# EAGLE schematic relay_block2 (EAGLE 7.6.0)
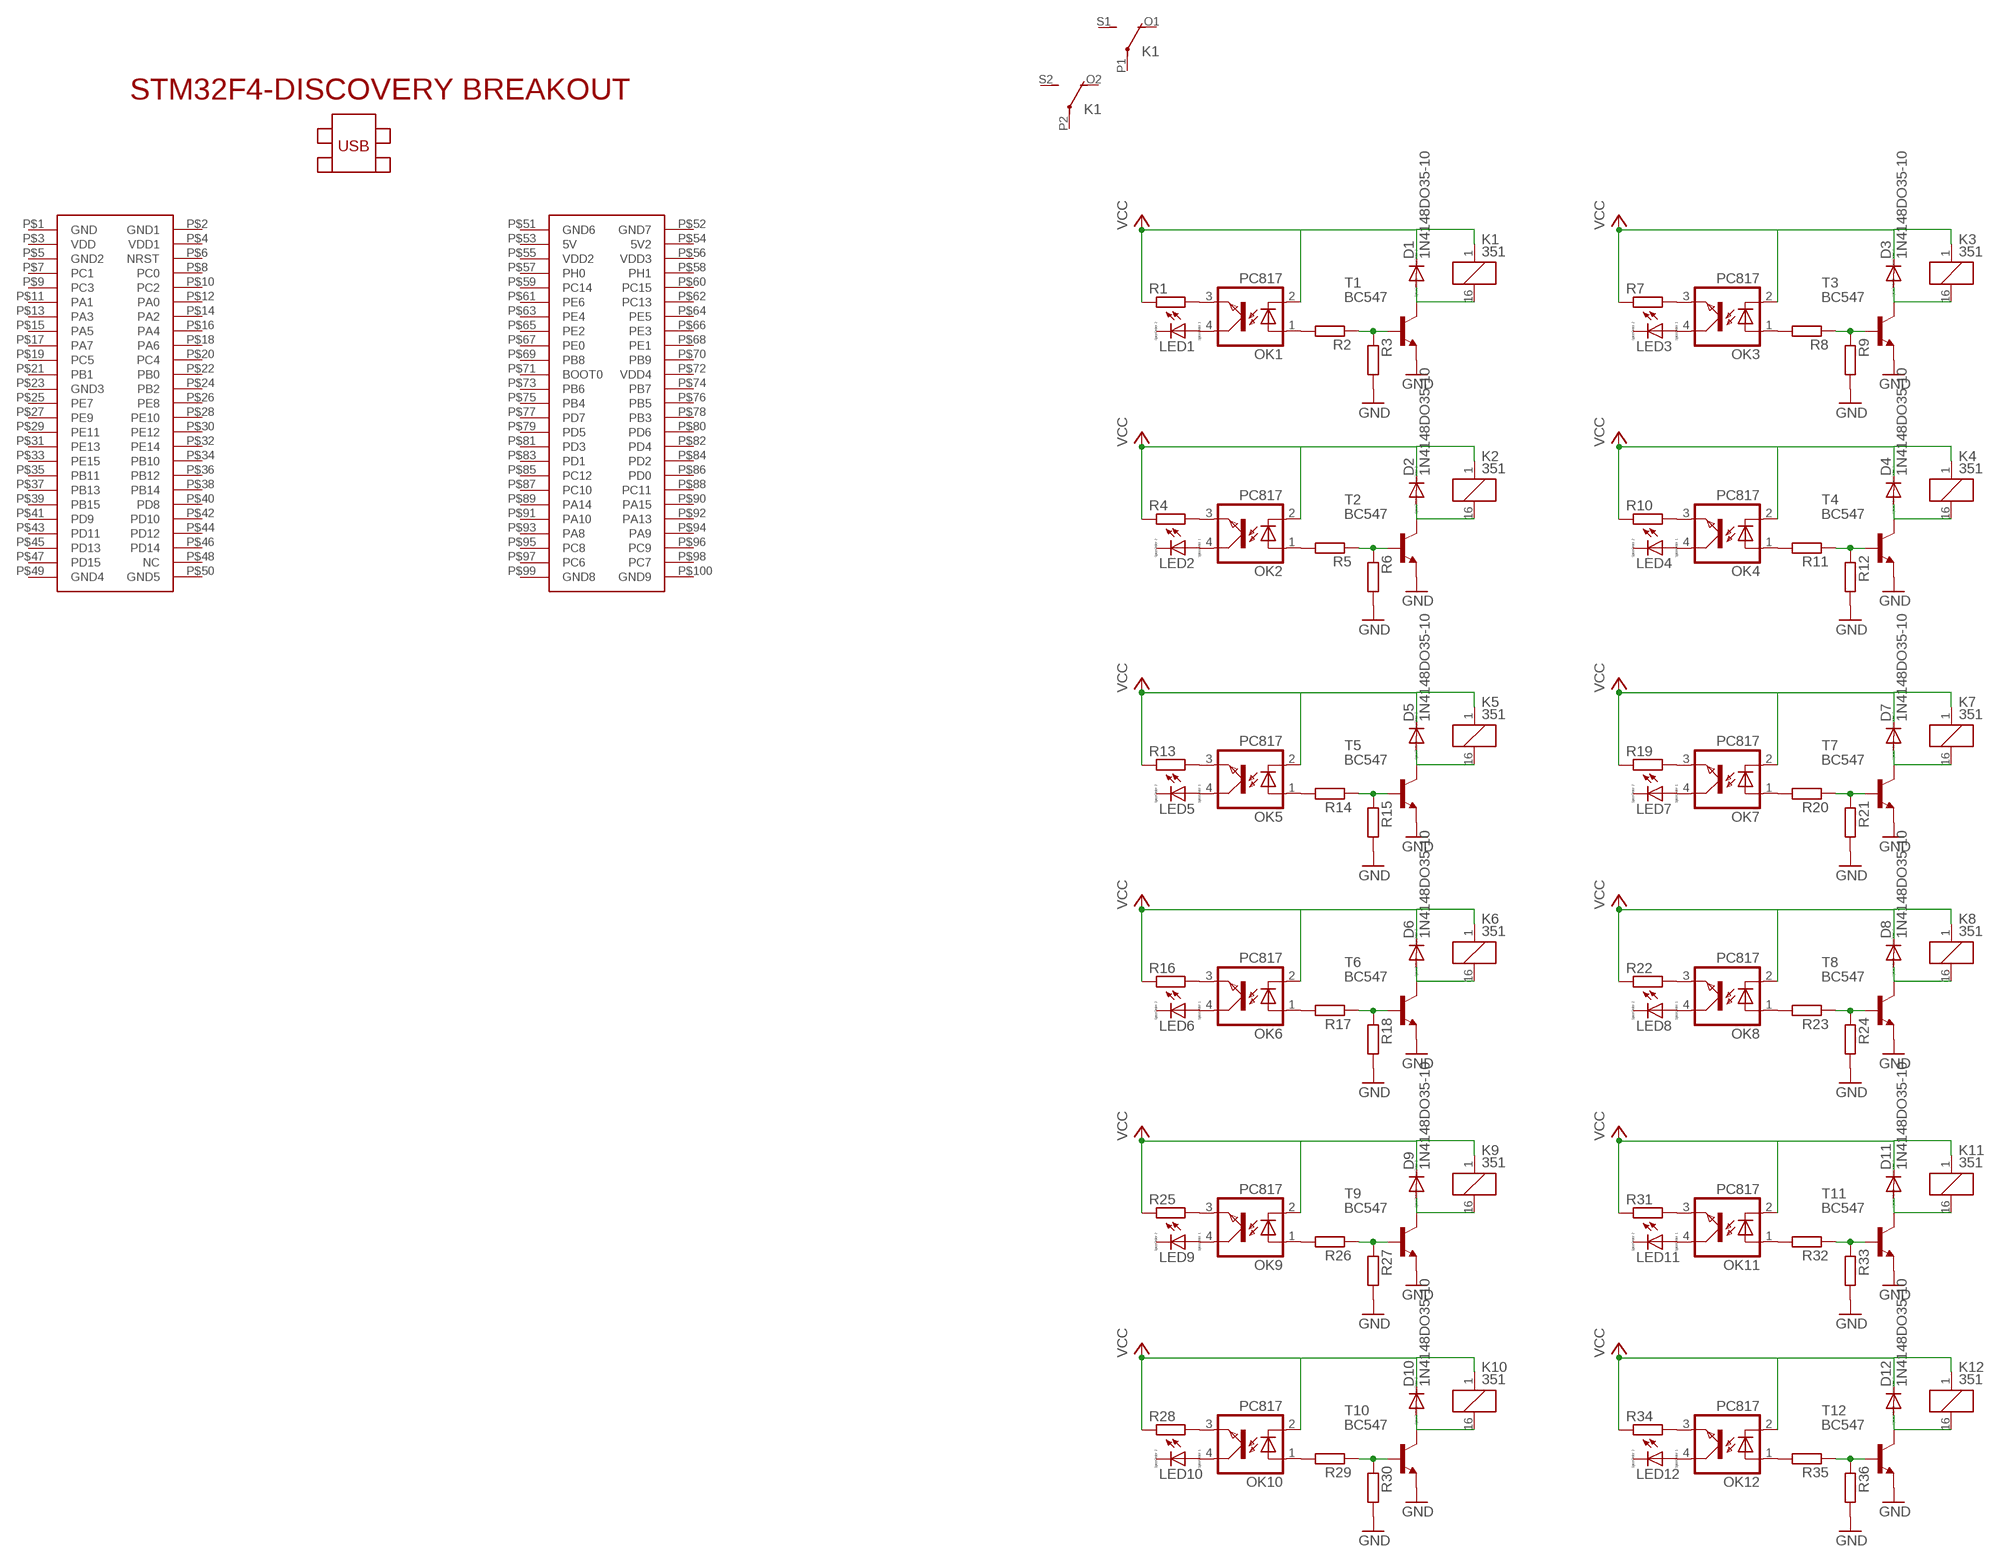
[diagram p0: schematic, sheet 1]

## Parts
D1  1N4148DO35-10  [DO35-10]
D2  1N4148DO35-10  [DO35-10]
D3  1N4148DO35-10  [DO35-10]
D4  1N4148DO35-10  [DO35-10]
D5  1N4148DO35-10  [DO35-10]
D6  1N4148DO35-10  [DO35-10]
D7  1N4148DO35-10  [DO35-10]
D8  1N4148DO35-10  [DO35-10]
D9  1N4148DO35-10  [DO35-10]
D10  1N4148DO35-10  [DO35-10]
D11  1N4148DO35-10  [DO35-10]
D12  1N4148DO35-10  [DO35-10]
K1  351  [351]
K2  351  [351]
K3  351  [351]
K4  351  [351]
K5  351  [351]
K6  351  [351]
K7  351  [351]
K8  351  [351]
K9  351  [351]
K10  351  [351]
K11  351  [351]
K12  351  [351]
LED1  LED_ELD260  [LED_LD260]
LED2  LED_ELD260  [LED_LD260]
LED3  LED_ELD260  [LED_LD260]
LED4  LED_ELD260  [LED_LD260]
LED5  LED_ELD260  [LED_LD260]
LED6  LED_ELD260  [LED_LD260]
LED7  LED_ELD260  [LED_LD260]
LED8  LED_ELD260  [LED_LD260]
LED9  LED_ELD260  [LED_LD260]
LED10  LED_ELD260  [LED_LD260]
LED11  LED_ELD260  [LED_LD260]
LED12  LED_ELD260  [LED_LD260]
OK1  PC817  [DIL04]
OK2  PC817  [DIL04]
OK3  PC817  [DIL04]
OK4  PC817  [DIL04]
OK5  PC817  [DIL04]
OK6  PC817  [DIL04]
OK7  PC817  [DIL04]
OK8  PC817  [DIL04]
OK9  PC817  [DIL04]
OK10  PC817  [DIL04]
OK11  PC817  [DIL04]
OK12  PC817  [DIL04]
R1  R-EU_M1206  [M1206]
R2  R-EU_M1206  [M1206]
R3  R-EU_M1206  [M1206]
R4  R-EU_M1206  [M1206]
R5  R-EU_M1206  [M1206]
R6  R-EU_M1206  [M1206]
R7  R-EU_M1206  [M1206]
R8  R-EU_M1206  [M1206]
R9  R-EU_M1206  [M1206]
R10  R-EU_M1206  [M1206]
R11  R-EU_M1206  [M1206]
R12  R-EU_M1206  [M1206]
R13  R-EU_M1206  [M1206]
R14  R-EU_M1206  [M1206]
R15  R-EU_M1206  [M1206]
R16  R-EU_M1206  [M1206]
R17  R-EU_M1206  [M1206]
R18  R-EU_M1206  [M1206]
R19  R-EU_M1206  [M1206]
R20  R-EU_M1206  [M1206]
R21  R-EU_M1206  [M1206]
R22  R-EU_M1206  [M1206]
R23  R-EU_M1206  [M1206]
R24  R-EU_M1206  [M1206]
R25  R-EU_M1206  [M1206]
R26  R-EU_M1206  [M1206]
R27  R-EU_M1206  [M1206]
R28  R-EU_M1206  [M1206]
R29  R-EU_M1206  [M1206]
R30  R-EU_M1206  [M1206]
R31  R-EU_M1206  [M1206]
R32  R-EU_M1206  [M1206]
R33  R-EU_M1206  [M1206]
R34  R-EU_M1206  [M1206]
R35  R-EU_M1206  [M1206]
R36  R-EU_M1206  [M1206]
T1  BC547  [TO92]
T2  BC547  [TO92]
T3  BC547  [TO92]
T4  BC547  [TO92]
T5  BC547  [TO92]
T6  BC547  [TO92]
T7  BC547  [TO92]
T8  BC547  [TO92]
T9  BC547  [TO92]
T10  BC547  [TO92]
T11  BC547  [TO92]
T12  BC547  [TO92]
U$1  STM32F4-DISCOVERY_STM32F4-DISCOVERY  [STM32F4-DISCOVERY_STM32F4-DISCOVERY]

## Nets
GND: R3.2 R6.2 R9.2 R12.2 R15.2 R18.2 R21.2 R24.2 R27.2 R30.2 R33.2 R36.2 T1.1(E) T2.1(E) T3.1(E) T4.1(E) T5.1(E) T6.1(E) T7.1(E) T8.1(E) T9.1(E) T10.1(E) T11.1(E) T12.1(E)
N$1: OK1.3(EMIT) R1.2
N$2: LED1.A OK1.4(COL)
N$3: OK1.1(A) R2.2
N$4: R2.1 R3.1 T1.2(B)
N$5: D1.A K1.16 T1.3(C)
N$7: OK2.3(EMIT) R4.2
N$8: LED2.A OK2.4(COL)
N$9: OK2.1(A) R5.2
N$10: R5.1 R6.1 T2.2(B)
N$11: D2.A K2.16 T2.3(C)
N$13: OK3.3(EMIT) R7.2
N$14: LED3.A OK3.4(COL)
N$15: OK3.1(A) R8.2
N$16: R8.1 R9.1 T3.2(B)
N$17: D3.A K3.16 T3.3(C)
N$19: OK4.3(EMIT) R10.2
N$20: LED4.A OK4.4(COL)
N$21: OK4.1(A) R11.2
N$22: R11.1 R12.1 T4.2(B)
N$23: D4.A K4.16 T4.3(C)
N$25: OK5.3(EMIT) R13.2
N$26: LED5.A OK5.4(COL)
N$27: OK5.1(A) R14.2
N$28: R14.1 R15.1 T5.2(B)
N$29: D5.A K5.16 T5.3(C)
N$31: OK6.3(EMIT) R16.2
N$32: LED6.A OK6.4(COL)
N$33: OK6.1(A) R17.2
N$34: R17.1 R18.1 T6.2(B)
N$35: D6.A K6.16 T6.3(C)
N$37: OK7.3(EMIT) R19.2
N$38: LED7.A OK7.4(COL)
N$39: OK7.1(A) R20.2
N$40: R20.1 R21.1 T7.2(B)
N$41: D7.A K7.16 T7.3(C)
N$43: OK8.3(EMIT) R22.2
N$44: LED8.A OK8.4(COL)
N$45: OK8.1(A) R23.2
N$46: R23.1 R24.1 T8.2(B)
N$47: D8.A K8.16 T8.3(C)
N$49: OK9.3(EMIT) R25.2
N$50: LED9.A OK9.4(COL)
N$51: OK9.1(A) R26.2
N$52: R26.1 R27.1 T9.2(B)
N$53: D9.A K9.16 T9.3(C)
N$55: OK10.3(EMIT) R28.2
N$56: LED10.A OK10.4(COL)
N$57: OK10.1(A) R29.2
N$58: R29.1 R30.1 T10.2(B)
N$59: D10.A K10.16 T10.3(C)
N$61: OK11.3(EMIT) R31.2
N$62: LED11.A OK11.4(COL)
N$63: OK11.1(A) R32.2
N$64: R32.1 R33.1 T11.2(B)
N$65: D11.A K11.16 T11.3(C)
N$67: OK12.3(EMIT) R34.2
N$68: LED12.A OK12.4(COL)
N$69: OK12.1(A) R35.2
N$70: R35.1 R36.1 T12.2(B)
N$71: D12.A K12.16 T12.3(C)
VCC: D1.C D2.C D3.C D4.C D5.C D6.C D7.C D8.C D9.C D10.C D11.C D12.C K1.1 K2.1 K3.1 K4.1 K5.1 K6.1 K7.1 K8.1 K9.1 K10.1 K11.1 K12.1 OK1.2(C) OK2.2(C) OK3.2(C) OK4.2(C) OK5.2(C) OK6.2(C) OK7.2(C) OK8.2(C) OK9.2(C) OK10.2(C) OK11.2(C) OK12.2(C) R1.1 R4.1 R7.1 R10.1 R13.1 R16.1 R19.1 R22.1 R25.1 R28.1 R31.1 R34.1
Unconnected: K1.O1(2:O) K1.O2(3:O) K1.P1(2:P) K1.P2(3:P) K1.S1(2:S) K1.S2(3:S) K2.O1(2:O) K2.O2(3:O) K2.P1(2:P) K2.P2(3:P) K2.S1(2:S) K2.S2(3:S) K3.O1(2:O) K3.O2(3:O) K3.P1(2:P) K3.P2(3:P) K3.S1(2:S) K3.S2(3:S) K4.O1(2:O) K4.O2(3:O) K4.P1(2:P) K4.P2(3:P) K4.S1(2:S) K4.S2(3:S) K5.O1(2:O) K5.O2(3:O) K5.P1(2:P) K5.P2(3:P) K5.S1(2:S) K5.S2(3:S) K6.O1(2:O) K6.O2(3:O) K6.P1(2:P) K6.P2(3:P) K6.S1(2:S) K6.S2(3:S) K7.O1(2:O) K7.O2(3:O) K7.P1(2:P) K7.P2(3:P) K7.S1(2:S) K7.S2(3:S) K8.O1(2:O) K8.O2(3:O) K8.P1(2:P) K8.P2(3:P) K8.S1(2:S) K8.S2(3:S) K9.O1(2:O) K9.O2(3:O) K9.P1(2:P) K9.P2(3:P) K9.S1(2:S) K9.S2(3:S) K10.O1(2:O) K10.O2(3:O) K10.P1(2:P) K10.P2(3:P) K10.S1(2:S) K10.S2(3:S) K11.O1(2:O) K11.O2(3:O) K11.P1(2:P) K11.P2(3:P) K11.S1(2:S) K11.S2(3:S) K12.O1(2:O) K12.O2(3:O) K12.P1(2:P) K12.P2(3:P) K12.S1(2:S) K12.S2(3:S) LED1.K(C) LED2.K(C) LED3.K(C) LED4.K(C) LED5.K(C) LED6.K(C) LED7.K(C) LED8.K(C) LED9.K(C) LED10.K(C) LED11.K(C) LED12.K(C) U$1.P$1(GND) U$1.P$2(GND1) U$1.P$3(VDD) U$1.P$4(VDD1) U$1.P$5(GND2) U$1.P$6(NRST) U$1.P$7(PC1) U$1.P$8(PC0) U$1.P$9(PC3) U$1.P$10(PC2) U$1.P$11(PA1) U$1.P$12(PA0) U$1.P$13(PA3) U$1.P$14(PA2) U$1.P$15(PA5) U$1.P$16(PA4) U$1.P$17(PA7) U$1.P$18(PA6) U$1.P$19(PC5) U$1.P$20(PC4) U$1.P$21(PB1) U$1.P$22(PB0) U$1.P$23(GND3) U$1.P$24(PB2) U$1.P$25(PE7) U$1.P$26(PE8) U$1.P$27(PE9) U$1.P$28(PE10) U$1.P$29(PE11) U$1.P$30(PE12) U$1.P$31(PE13) U$1.P$32(PE14) U$1.P$33(PE15) U$1.P$34(PB10) U$1.P$35(PB11) U$1.P$36(PB12) U$1.P$37(PB13) U$1.P$38(PB14) U$1.P$39(PB15) U$1.P$40(PD8) U$1.P$41(PD9) U$1.P$42(PD10) U$1.P$43(PD11) U$1.P$44(PD12) U$1.P$45(PD13) U$1.P$46(PD14) U$1.P$47(PD15) U$1.P$48(NC) U$1.P$49(GND4) U$1.P$50(GND5) U$1.P$51(GND6) U$1.P$52(GND7) U$1.P$53(5V) U$1.P$54(5V2) U$1.P$55(VDD2) U$1.P$56(VDD3) U$1.P$57(PH0) U$1.P$58(PH1) U$1.P$59(PC14) U$1.P$60(PC15) U$1.P$61(PE6) U$1.P$62(PC13) U$1.P$63(PE4) U$1.P$64(PE5) U$1.P$65(PE2) U$1.P$66(PE3) U$1.P$67(PE0) U$1.P$68(PE1) U$1.P$69(PB8) U$1.P$70(PB9) U$1.P$71(BOOT0) U$1.P$72(VDD4) U$1.P$73(PB6) U$1.P$74(PB7) U$1.P$75(PB4) U$1.P$76(PB5) U$1.P$77(PD7) U$1.P$78(PB3) U$1.P$79(PD5) U$1.P$80(PD6) U$1.P$81(PD3) U$1.P$82(PD4) U$1.P$83(PD1) U$1.P$84(PD2) U$1.P$85(PC12) U$1.P$86(PD0) U$1.P$87(PC10) U$1.P$88(PC11) U$1.P$89(PA14) U$1.P$90(PA15) U$1.P$91(PA10) U$1.P$92(PA13) U$1.P$93(PA8) U$1.P$94(PA9) U$1.P$95(PC8) U$1.P$96(PC9) U$1.P$97(PC6) U$1.P$98(PC7) U$1.P$99(GND8) U$1.P$100(GND9)

## Library data of the parts
D1-D12 = diode:1N4148: DIODE high speed (Philips)
K1-K12 = relay:351: RELAY 2 x switch, Omron; OC_FARNELL: unknown; OC_NEWARK: unknown
LED1-LED12 = eagle-ltspice:LED_E: LED Source: http://www.osram.convergy.de Source: www.luxeon.com Source: www.kingbright.com; SPICEMODEL: NONE; SPICEPREFIX: D; SPICETYPE: diode
OK1-OK12 = optocoupler:PC817: SHARP OPTO COUPLER; MPN: PC817X4J000F; OC_FARNELL: 9707727; OC_NEWARK: 97K7059
R1-R36 = resistor:R-EU_: RESISTOR, European symbol
T1-T12 = transistor:BC547: NPN TRANSISTOR
U$1 = stm32f4-discovery-breakout-v1:STM32F4-DISCOVERY_STM32F4-DISCOVERY